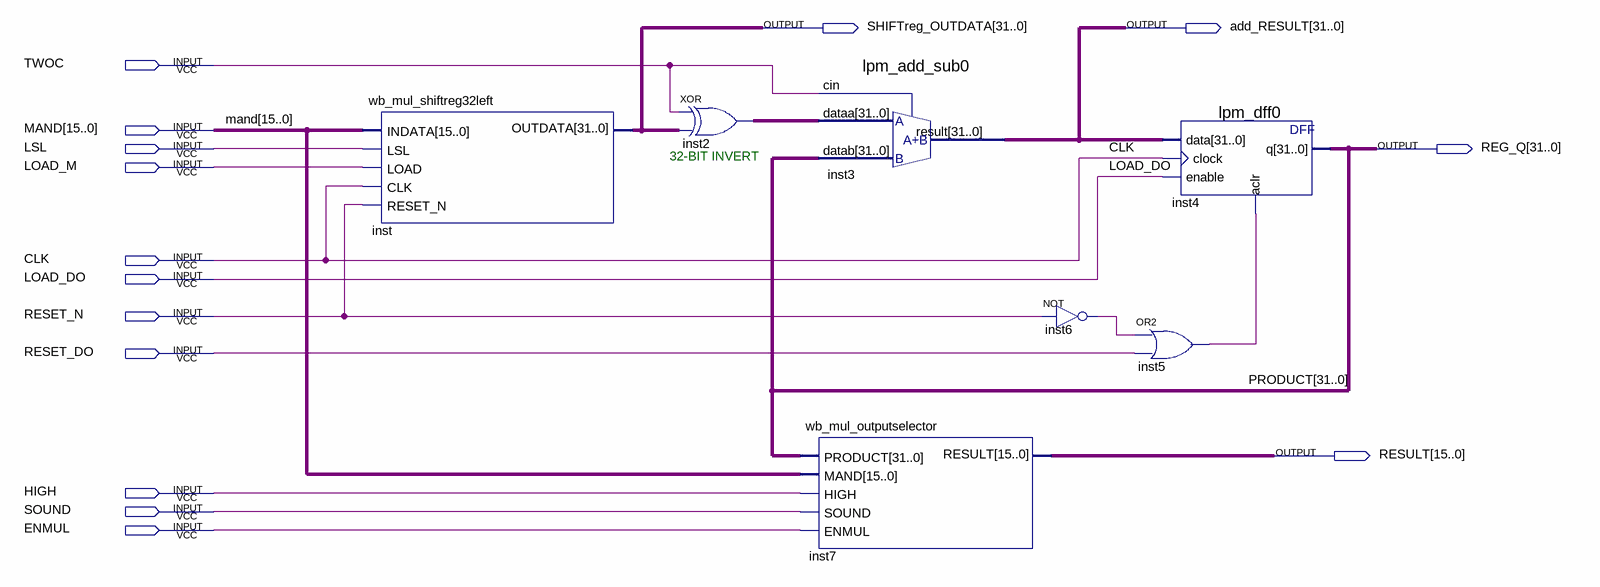
[diagram p0: schematic sheet]
// Quartus schematic mul_data_path_tst.bdf as structural Verilog: 7 symbols, 15 pins
module mul_data_path_tst (
  input  TWOC,
  input  [15:0] MAND,
  input  LSL,
  input  LOAD_M,
  input  CLK,
  input  LOAD_DO,
  input  RESET_N,
  input  RESET_DO,
  input  HIGH,
  input  SOUND,
  input  ENMUL,
  output [31:0] SHIFTreg_OUTDATA,
  output [31:0] add_RESULT,
  output [31:0] REG_Q,
  output [15:0] RESULT
);

  wire inst5_out, inst6_out;
  wire [31:0] inst2_out;

  wb_mul_shiftreg32left inst (
    .INDATA(MAND), .LSL(LSL), .CLK(CLK), .RESET_N(RESET_N), .LOAD(LOAD_M), .OUTDATA(SHIFTreg_OUTDATA));
  assign inst2_out = {32{TWOC}} ^ SHIFTreg_OUTDATA;  // XOR inst2, 32 bits wide
  lpm_add_sub0 inst3 (.dataa(inst2_out), .datab(REG_Q), .cin(TWOC), .result(add_RESULT));
  wb_mul_outputselector inst7 (
    .MAND(MAND), .PRODUCT(REG_Q), .HIGH(HIGH), .SOUND(SOUND), .ENMUL(ENMUL), .RESULT(RESULT));
  not inst6 (inst6_out, RESET_N);
  or inst5 (inst5_out, inst6_out, RESET_DO);
  lpm_dff0 inst4 (.data(add_RESULT), .clock(CLK), .enable(LOAD_DO), .aclr(inst5_out), .q(REG_Q));

  // Other names for the same wires on the sheet: PRODUCT[31:0] = REG_Q

  // Notes on the sheet:
  //   32-BIT INVERT
endmodule
